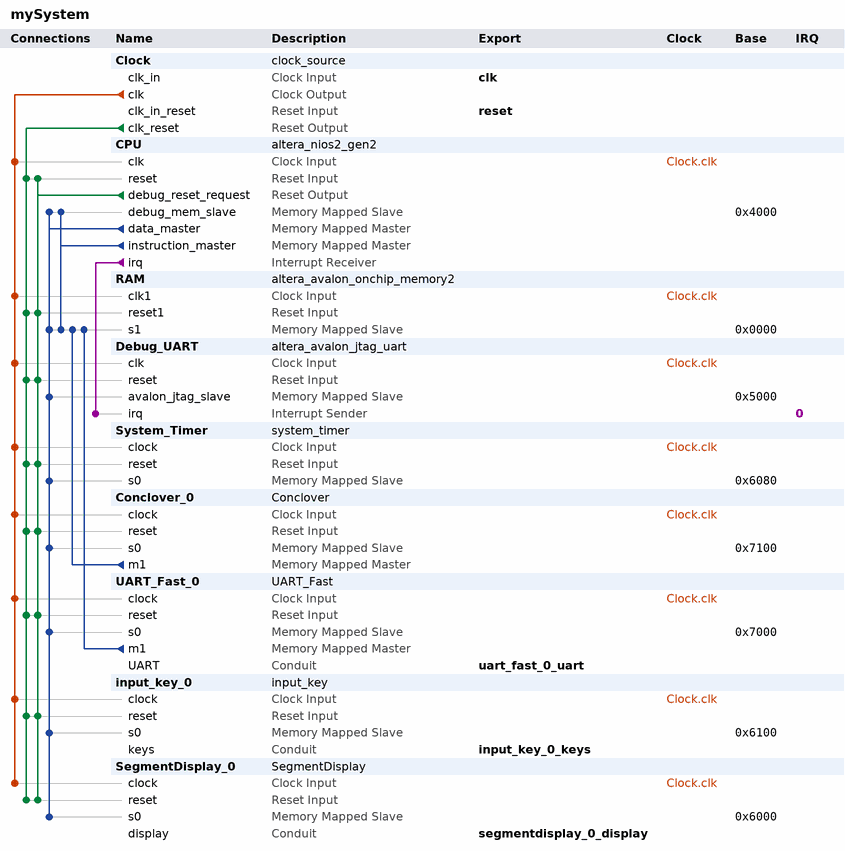
[diagram p0: system contents]
# Platform Designer (Qsys) system mySystem, Cyclone IV E EP4CE6E22C8
# Parameters at their usual value, and those the tool derives, are not listed.
package require -exact qsys 18.1
create_system mySystem
set_project_property DEVICE_FAMILY {Cyclone IV E}
set_project_property DEVICE EP4CE6E22C8

add_instance Clock clock_source 18.1
set_instance_parameter_value Clock clockFrequency 50000000

add_instance CPU altera_nios2_gen2 18.1
set_instance_parameter_value CPU dcache_size 2048
set_instance_parameter_value CPU exceptionSlave RAM.s1
set_instance_parameter_value CPU icache_size 4096
set_instance_parameter_value CPU impl Tiny
set_instance_parameter_value CPU resetSlave RAM.s1

add_instance RAM altera_avalon_onchip_memory2 18.1
set_instance_parameter_value RAM dataWidth 32
set_instance_parameter_value RAM dualPort false
set_instance_parameter_value RAM initMemContent true
set_instance_parameter_value RAM initializationFileName onchip_mem.hex
set_instance_parameter_value RAM memorySize 16384

add_instance Debug_UART altera_avalon_jtag_uart 18.1
set_instance_parameter_value Debug_UART simInteractiveOptions NO_INTERACTIVE_WINDOWS

add_instance System_Timer system_timer 1.0

add_instance Conclover_0 Conclover 1.0

add_instance UART_Fast_0 UART_Fast 1.0

add_instance input_key_0 input_key 1.0

add_instance SegmentDisplay_0 SegmentDisplay 1.0

# connections
add_connection Clock.clk Conclover_0.clock clock
add_connection Clock.clk CPU.clk clock
add_connection Clock.clk Debug_UART.clk clock
add_connection Clock.clk input_key_0.clock clock
add_connection Clock.clk RAM.clk1 clock
add_connection Clock.clk SegmentDisplay_0.clock clock
add_connection Clock.clk System_Timer.clock clock
add_connection Clock.clk UART_Fast_0.clock clock
add_connection Clock.clk_reset Conclover_0.reset reset
add_connection Clock.clk_reset CPU.reset reset
add_connection Clock.clk_reset Debug_UART.reset reset
add_connection Clock.clk_reset input_key_0.reset reset
add_connection Clock.clk_reset RAM.reset1 reset
add_connection Clock.clk_reset SegmentDisplay_0.reset reset
add_connection Clock.clk_reset System_Timer.reset reset
add_connection Clock.clk_reset UART_Fast_0.reset reset
add_connection CPU.debug_reset_request Conclover_0.reset reset
add_connection CPU.debug_reset_request CPU.reset reset
add_connection CPU.debug_reset_request Debug_UART.reset reset
add_connection CPU.debug_reset_request input_key_0.reset reset
add_connection CPU.debug_reset_request RAM.reset1 reset
add_connection CPU.debug_reset_request SegmentDisplay_0.reset reset
add_connection CPU.debug_reset_request System_Timer.reset reset
add_connection CPU.debug_reset_request UART_Fast_0.reset reset
add_connection Conclover_0.m1 RAM.s1 avalon
set_connection_parameter_value Conclover_0.m1/RAM.s1 baseAddress 0x0000
add_connection CPU.data_master Conclover_0.s0 avalon
set_connection_parameter_value CPU.data_master/Conclover_0.s0 baseAddress 0x7100
add_connection CPU.data_master CPU.debug_mem_slave avalon
set_connection_parameter_value CPU.data_master/CPU.debug_mem_slave baseAddress 0x4000
add_connection CPU.data_master Debug_UART.avalon_jtag_slave avalon
set_connection_parameter_value CPU.data_master/Debug_UART.avalon_jtag_slave baseAddress 0x5000
add_connection CPU.data_master input_key_0.s0 avalon
set_connection_parameter_value CPU.data_master/input_key_0.s0 baseAddress 0x6100
add_connection CPU.data_master RAM.s1 avalon
set_connection_parameter_value CPU.data_master/RAM.s1 baseAddress 0x0000
add_connection CPU.data_master SegmentDisplay_0.s0 avalon
set_connection_parameter_value CPU.data_master/SegmentDisplay_0.s0 baseAddress 0x6000
add_connection CPU.data_master System_Timer.s0 avalon
set_connection_parameter_value CPU.data_master/System_Timer.s0 baseAddress 0x6080
add_connection CPU.data_master UART_Fast_0.s0 avalon
set_connection_parameter_value CPU.data_master/UART_Fast_0.s0 baseAddress 0x7000
add_connection CPU.instruction_master CPU.debug_mem_slave avalon
set_connection_parameter_value CPU.instruction_master/CPU.debug_mem_slave baseAddress 0x4000
add_connection CPU.instruction_master RAM.s1 avalon
set_connection_parameter_value CPU.instruction_master/RAM.s1 baseAddress 0x0000
add_connection UART_Fast_0.m1 RAM.s1 avalon
set_connection_parameter_value UART_Fast_0.m1/RAM.s1 baseAddress 0x0000
add_connection CPU.irq Debug_UART.irq interrupt
set_connection_parameter_value CPU.irq/Debug_UART.irq irqNumber 0

# exported interfaces
add_interface clk clock sink
set_interface_property clk EXPORT_OF Clock.clk_in
add_interface input_key_0_keys conduit end
set_interface_property input_key_0_keys EXPORT_OF input_key_0.keys
add_interface reset reset sink
set_interface_property reset EXPORT_OF Clock.clk_in_reset
add_interface segmentdisplay_0_display conduit end
set_interface_property segmentdisplay_0_display EXPORT_OF SegmentDisplay_0.display
add_interface uart_fast_0_uart conduit end
set_interface_property uart_fast_0_uart EXPORT_OF UART_Fast_0.UART

set_interconnect_requirement {$system} qsys_mm.clockCrossingAdapter HANDSHAKE
set_interconnect_requirement {$system} qsys_mm.enableEccProtection FALSE
set_interconnect_requirement {$system} qsys_mm.insertDefaultSlave FALSE
set_interconnect_requirement {$system} qsys_mm.maxAdditionalLatency 1

save_system mySystem.qsys
